# Altium schematic sheet CanRotor_Mini(2).SchDoc: Canrotor_Mini
size A4; Author: WHS; Organization: 깡통로봇연구소; Address1: Korea; Address2: Gwangju; Address3: Cafe; Revision: 8.0; SheetNumber: 2; SheetTotal: 2; ProjectName: CanRotor_Mini
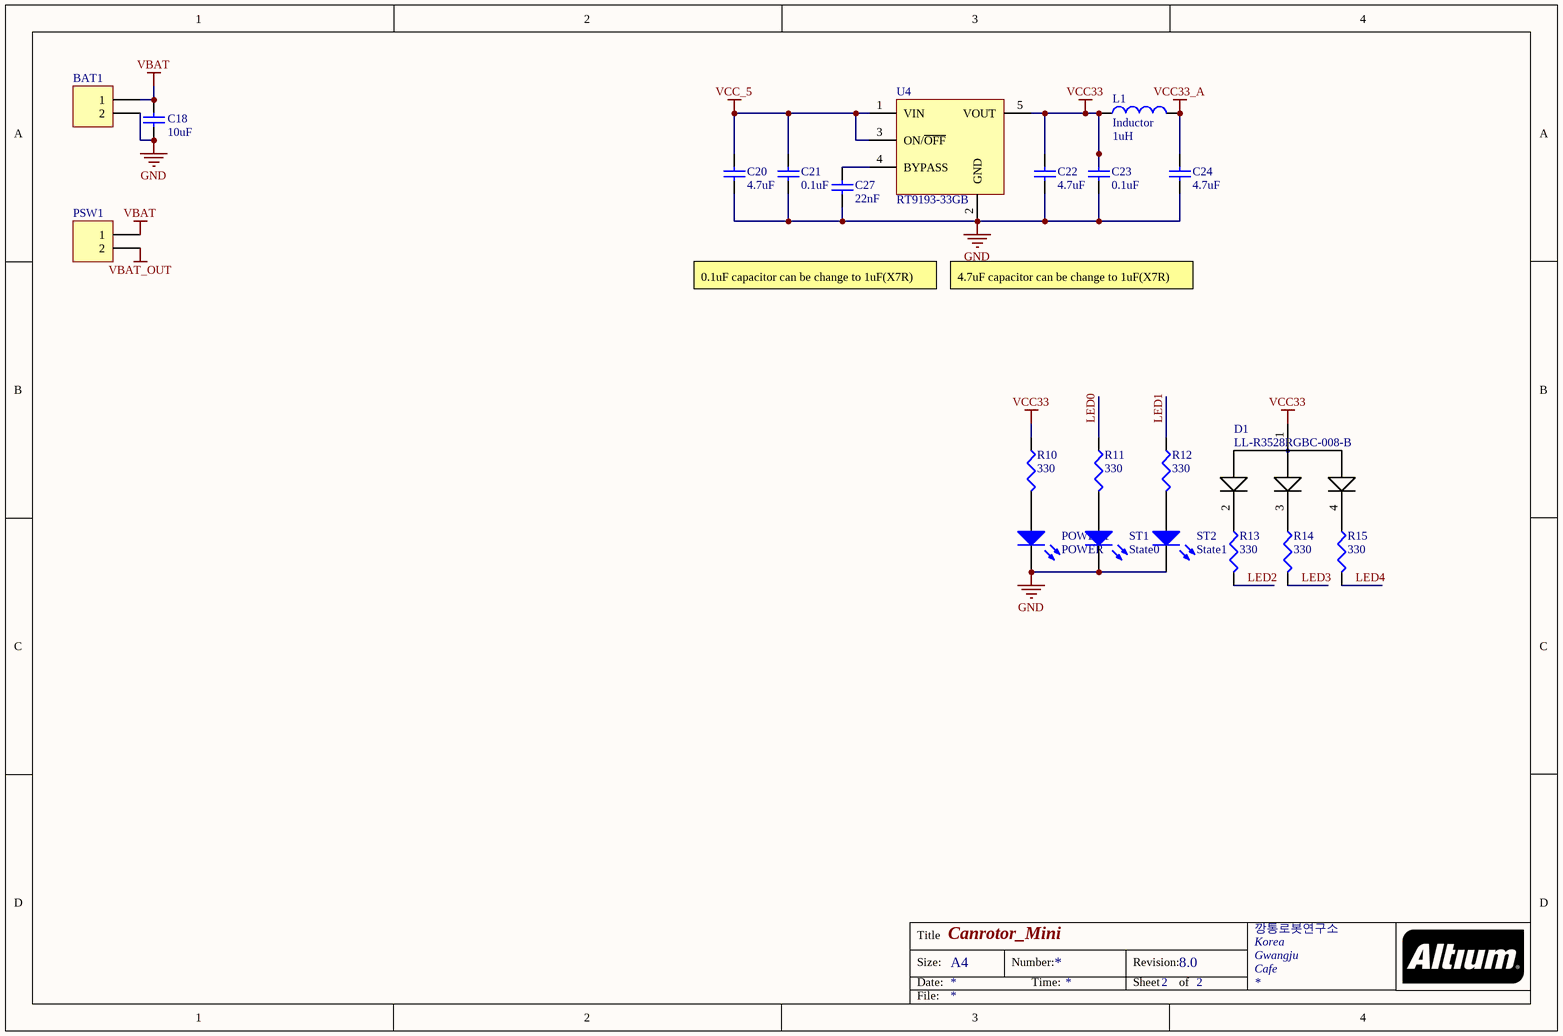
[diagram p0: CanRotor_Mini(2).SchDoc]

## Parts
BAT1  Header 2  [HDR1X2]  (value not drawn)
C18  value 10uF  [C1206]  (hidden comment: Cap Semi)
C20  value 4.7uF  [C1206]  (hidden comment: Cap Semi)
C21  value 0.1uF  [1608[0603]]  (hidden comment: Cap Semi)
C22  value 4.7uF  [6-0805_L]  (hidden comment: Cap Semi)
C23  value 0.1uF  [1608[0603]]  (hidden comment: Cap Semi)
C24  value 4.7uF  [6-0805_L]  (hidden comment: Cap Semi)
C27  value 22nF  [1608[0603]]  (hidden comment: Cap Semi)
D1  LL-R3528RGBC-008-B  [LED_LL-R3528RGBC-008-B]
L1  Inductor  value 1uH  [1608[0603]]
POWER1  POWER  [LED0603]
PSW1  Header 2  [HDR1X2]  (value not drawn)
R10  value 330  [J1-0603]  (hidden comment: Res3)
R11  value 330  [J1-0603]  (hidden comment: Res3)
R12  value 330  [J1-0603]  (hidden comment: Res3)
R13  value 330  [J1-0603]  (hidden comment: Res3)
R14  value 330  [J1-0603]  (hidden comment: Res3)
R15  value 330  [J1-0603]  (hidden comment: Res3)
ST1  State0  [LED0603]
ST2  State1  [LED0603]
U4  RT9193-33GB  [SOT-23-5]

## Nets
GND: BAT1.2 C18.2 C20.2 C21.2 C22.2 C23.2 C24.2 C27.2 POWER1.2(K) ST1.2(K) ST2.2(K) U4.2(GND)
VBAT: BAT1.1 C18.1 PSW1.1
VBAT_OUT: PSW1.2
VCC33: C22.1 C23.1 D1.1(COMM_ANODE) L1.1 R10.1 U4.5(VOUT)
VCC33_A: C24.1 L1.2
VCC_5: C20.1 C21.1 U4.1(VIN) U4.3(ON/~{OFF})
LED0: R11.1
LED1: R12.1
LED2: R13.2
LED3: R14.2
LED4: R15.2
NetC27_1: C27.1 U4.4(BYPASS)
NetD1_2: D1.2(CATHODE_RED) R13.1
NetD1_3: D1.3(CATHODE_GREEN) R14.1
NetD1_4: D1.4(CATHODE_BLUE) R15.1
NetPOWER1_1: POWER1.1(A) R10.2
NetR11_2: R11.2 ST1.1(A)
NetR12_2: R12.2 ST2.1(A)

## Notes on the sheet
- 0.1uF capacitor can be change to 1uF(X7R)
- 4.7uF capacitor can be change to 1uF(X7R)
- Title
- Size:
- Date:
- A4
- Number:
- Time:
- Revision:
- Sheet
- of
- File:

## Library data of the parts
BAT1 PSW1 = Header 2: Header, 2-Pin; LatestRevisionDate: 17-Jul-2002; LatestRevisionNote: Re-released for DXP Platform.; Publisher: Altium Limited
C18 C20-C24 C27 = Cap Semi: Capacitor (Semiconductor SIM Model); Published: 8-Jun-2000; LatestRevisionDate: 29-May-2009; LatestRevisionNote: IPC-7351 Footprint Added.; PackageReference: C1206; Publisher: Altium Limited; PackageDescription: Chip Capacitor
D1 = LL-R3528RGBC-008-B: LED; SMD; 3528, PLCC2; RGB; 3.5x2.8mm; 120째; Red lumin: 1; MF: Lucky Light; SnapEDA_Link: https://www.snapeda.com/parts/LL-R3528RGBC-008-B/Lucky%20Light/view-part/?ref=snap; Package: PLCC-2 Lucky Light; MP: LL-R3528RGBC-008-B; Availability: Unavailable; Price: None; Value: *
L1 = Inductor: Code_IEC: 1005; Published: 8-Jun-2000; LatestRevisionDate: 29-May-2009; LatestRevisionNote: IPC-7351 Footprint Added.; PackageReference: 0402-A; Publisher: Altium Limited; PackageDescription: Chip Inductor; Code_JEITA: 0402
POWER1 ST1 ST2 = LED2: Typical RED, GREEN, YELLOW, AMBER GaAs LED; Published: 8-Jun-2000; LatestRevisionDate: 17-Jul-2002; LatestRevisionNote: Re-released for DXP Platform.; PackageVersion: Feb-2002; PackageReference: 3.2X1.6X1.1; Publisher: Altium Limited; PackageDescription: SM LED; 2 Flat Leads
R10-R15 = Res3: Resistor; Published: 8-Jun-2000; LatestRevisionDate: 29-May-2009; LatestRevisionNote: IPC-7351 Footprint Added.; PackageReference: J1-0603; Publisher: Altium Limited; PackageDescription: Chip Resistor